# EAGLE design dacpower (EAGLE 8.1.1)
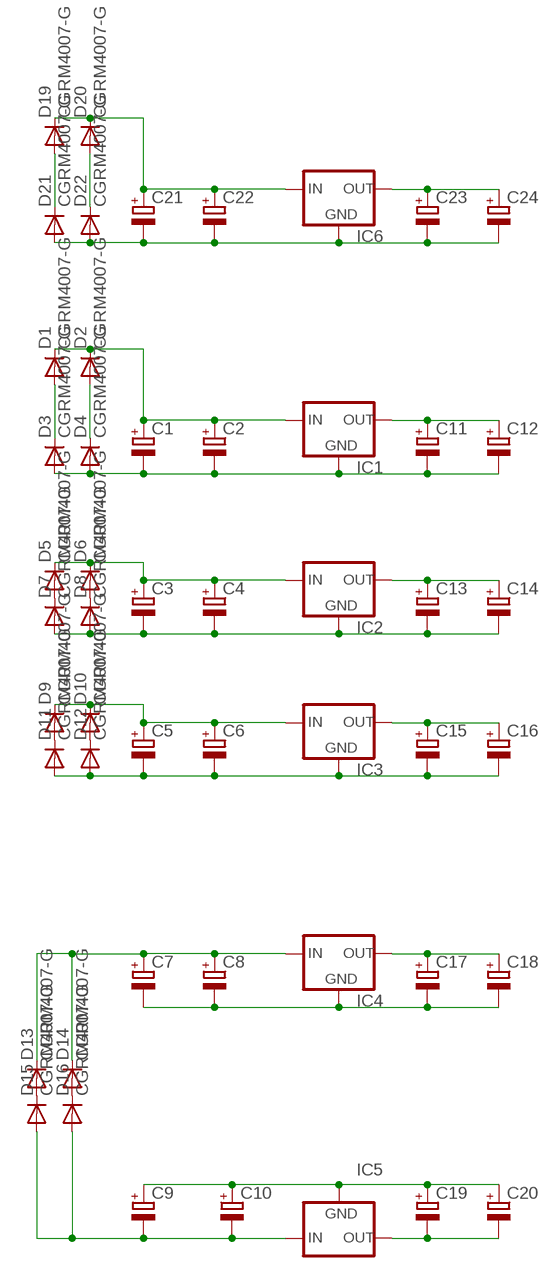
[diagram p0: schematic, sheet 1]

## Parts
C1  CPOL-EUE7.5-18  [E7,5-18]
C2  CPOL-EUE7.5-18  [E7,5-18]
C3  CPOL-EUE7.5-18  [E7,5-18]
C4  CPOL-EUE7.5-18  [E7,5-18]
C5  CPOL-EUE7.5-18  [E7,5-18]
C6  CPOL-EUE7.5-18  [E7,5-18]
C7  CPOL-EUE7.5-18  [E7,5-18]
C8  CPOL-EUE7.5-18  [E7,5-18]
C9  CPOL-EUE7.5-18  [E7,5-18]
C10  CPOL-EUE7.5-18  [E7,5-18]
C11  CPOL-EUSP-CAP-CX  [SP-CAP-CX]
C12  CPOL-EUSP-CAP-CX  [SP-CAP-CX]
C13  CPOL-EUSP-CAP-CX  [SP-CAP-CX]
C14  CPOL-EUSP-CAP-CX  [SP-CAP-CX]
C15  CPOL-EUSP-CAP-CX  [SP-CAP-CX]
C16  CPOL-EUSP-CAP-CX  [SP-CAP-CX]
C17  CPOL-EUSP-CAP-CX  [SP-CAP-CX]
C18  CPOL-EUSP-CAP-CX  [SP-CAP-CX]
C19  CPOL-EUSP-CAP-CX  [SP-CAP-CX]
C20  CPOL-EUSP-CAP-CX  [SP-CAP-CX]
C21  CPOL-EUE7.5-18  [E7,5-18]
C22  CPOL-EUE7.5-18  [E7,5-18]
C23  CPOL-EUSP-CAP-CX  [SP-CAP-CX]
C24  CPOL-EUSP-CAP-CX  [SP-CAP-CX]
D1  CGRM4007-G  [SOD-123_MINI-SMA]
D2  CGRM4007-G  [SOD-123_MINI-SMA]
D3  CGRM4007-G  [SOD-123_MINI-SMA]
D4  CGRM4007-G  [SOD-123_MINI-SMA]
D5  CGRM4007-G  [SOD-123_MINI-SMA]
D6  CGRM4007-G  [SOD-123_MINI-SMA]
D7  CGRM4007-G  [SOD-123_MINI-SMA]
D8  CGRM4007-G  [SOD-123_MINI-SMA]
D9  CGRM4007-G  [SOD-123_MINI-SMA]
D10  CGRM4007-G  [SOD-123_MINI-SMA]
D11  CGRM4007-G  [SOD-123_MINI-SMA]
D12  CGRM4007-G  [SOD-123_MINI-SMA]
D13  CGRM4007-G  [SOD-123_MINI-SMA]
D14  CGRM4007-G  [SOD-123_MINI-SMA]
D15  CGRM4007-G  [SOD-123_MINI-SMA]
D16  CGRM4007-G  [SOD-123_MINI-SMA]
D19  CGRM4007-G  [SOD-123_MINI-SMA]
D20  CGRM4007-G  [SOD-123_MINI-SMA]
D21  CGRM4007-G  [SOD-123_MINI-SMA]
D22  CGRM4007-G  [SOD-123_MINI-SMA]
IC1  78XXS  [78XXS]
IC2  78XXS  [78XXS]
IC3  78XXS  [78XXS]
IC4  78XXS  [78XXS]
IC5  79XXS  [79XXS]
IC6  78XXS  [78XXS]

## Nets
N$1: C1.+ C2.+ D1.C D2.C IC1.IN
N$2: C1.- C2.- C11.- C12.- D3.A D4.A IC1.GND
N$3: C3.+ C4.+ D5.C D6.C IC2.IN
N$4: C3.- C4.- C13.- C14.- D7.A D8.A IC2.GND
N$5: C5.+ C6.+ D9.C D10.C IC3.IN
N$6: C5.- C6.- C15.- C16.- D11.A D12.A IC3.GND
N$7: C7.+ C8.+ D13.C D14.C IC4.IN
N$8: C7.- C8.- C17.- C18.- IC4.GND
N$9: C9.+ C10.+ C19.+ C20.+ IC5.GND
N$10: C9.- C10.- D15.A D16.A IC5.IN
N$11: C19.- C20.- IC5.OUT
N$12: D1.A D3.C
N$13: C17.+ C18.+ IC4.OUT
N$14: C15.+ C16.+ IC3.OUT
N$15: C13.+ C14.+ IC2.OUT
N$16: C11.+ C12.+ IC1.OUT
N$17: D5.A D7.C
N$18: D6.A D8.C
N$19: D9.A D11.C
N$20: D10.A D12.C
N$21: D13.A D15.C
N$22: D14.A D16.C
N$23: D2.A D4.C
N$24: C21.+ C22.+ D19.C D20.C IC6.IN
N$25: C21.- C22.- C23.- C24.- D21.A D22.A IC6.GND
N$26: C23.+ C24.+ IC6.OUT
N$27: D19.A D21.C
N$28: D20.A D22.C

## Library data of the parts
C1-C24 = Vwvwbg:CPOL-EU: POLARIZED CAPACITOR, European symbol
D1-D16 D19-D22 = diode:CGRM400*-G: Molded plasitc,JEDEC SOD-123/Mini SMA Source: Comchip CGRM4001-G.pdf
IC1-IC4 IC6 = v-reg:78XXS: VOLTAGE REGULATOR
IC5 = v-reg:79XXS: VOLTAGE REGULATOR

## Board
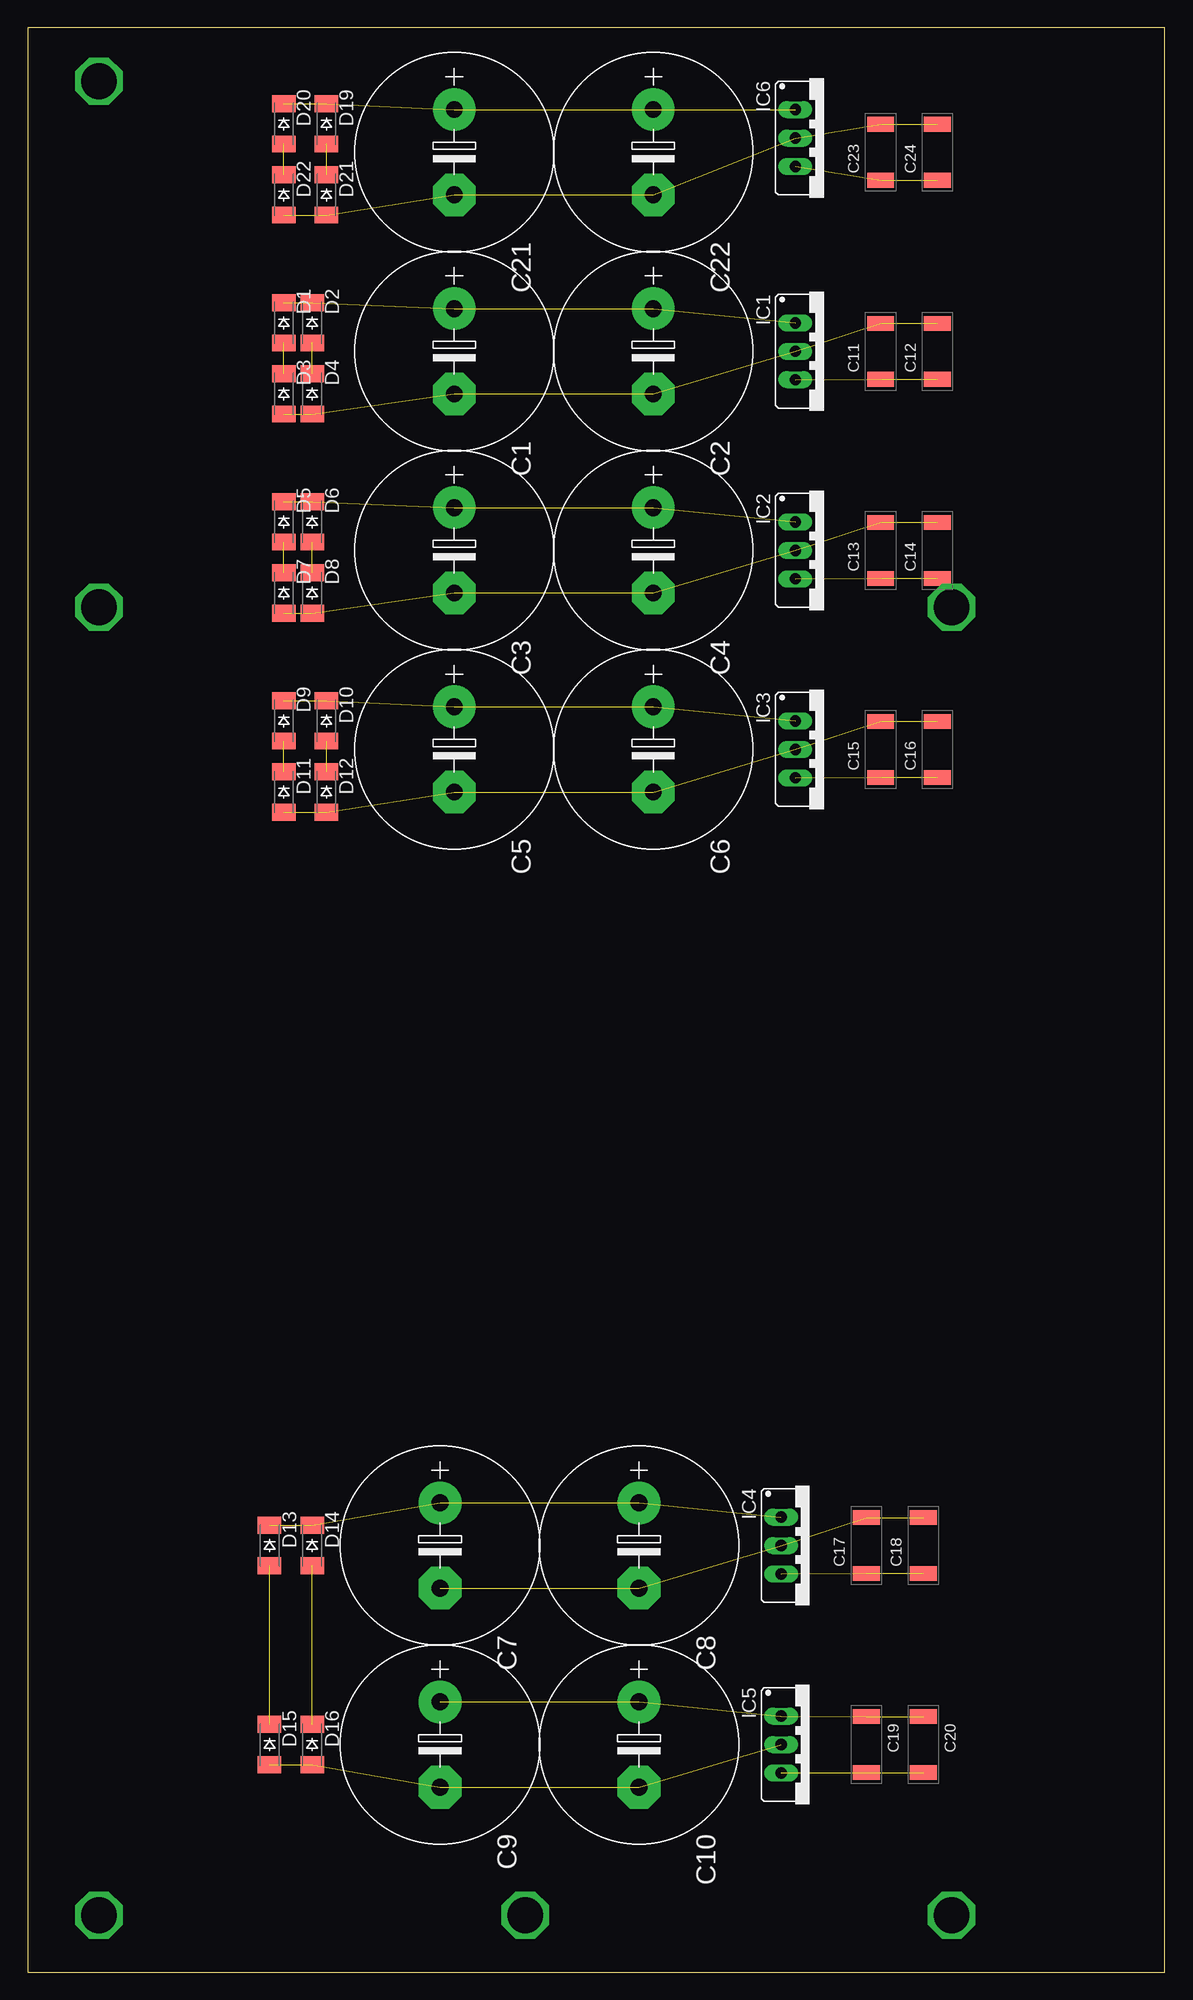
[diagram p1: board, top side]

Size 101.58 x 173.66 mm. Coordinates in mm from the lower left corner, seen from the top.
Outline: 0,0 101.58,0 101.58,173.66 0,173.66 0,0
Copper layers (1*16): Top 0.035mm / dielectric 1.5mm / Bottom 0.035mm
Design rules "default": minimum track width 10mil, minimum drill 24mil, track to track 8mil, track to pad 8mil, pad to pad 8mil, via to via 8mil, smd to smd 8mil, copper to edge 40mil, drill to drill 8mil, minimum pad ring 10mil, minimum via ring 8mil, stop-mask expansion 4mil, vias tented up to drill 0mil, thermal gap 10mil

### Footprints (pad centres in the part's own frame; a part is rotated, then mirrored left to right if it is on the bottom)
E7,5-18 = drill 1.5 pad 3.81: + -3.81,0 | drill 1.5 pad 3.81 octagon: - 3.81,0
SP-CAP-CX = smd 1.3 x 2.4: + -2.5,0; - 2.5,0
SOD-123_MINI-SMA = smd 1.5 x 2.1: A 1.8,0; C -1.8,0
78XXS = drill 1.016 long: GND 0,-2.54; IN -2.54,-2.54; OUT 2.54,-2.54
79XXS = drill 1.016 long: GND -2.54,-2.54; IN 0,-2.54; OUT 2.54,-2.54

### Placement (x,y rotation side)
C1  38.1,144.78 270 top
C2  55.88,144.78 270 top
C3  38.1,127 270 top
C4  55.88,127 270 top
C5  38.1,109.22 270 top
C6  55.88,109.22 270 top
C7  36.83,38.1 270 top
C8  54.61,38.1 270 top
C9  36.83,20.32 270 top
C10  54.61,20.32 270 top
C11  76.2,144.78 90 top
C12  81.28,144.78 90 top
C13  76.2,127 90 top
C14  81.28,127 90 top
C15  76.2,109.22 90 top
C16  81.28,109.22 90 top
C17  74.93,38.1 90 top
C18  80.01,38.1 90 top
C19  74.93,20.32 270 top
C20  80.01,20.32 270 top
C21  38.1,162.56 270 top
C22  55.88,162.56 270 top
C23  76.2,162.56 90 top
C24  81.28,162.56 90 top
D1  22.86,147.32 270 top
D2  25.4,147.32 270 top
D3  22.86,140.97 270 top
D4  25.4,140.97 270 top
D5  22.86,129.54 270 top
D6  25.4,129.54 270 top
D7  22.86,123.19 270 top
D8  25.4,123.19 270 top
D9  22.86,111.76 270 top
D10  26.67,111.76 270 top
D11  22.86,105.41 270 top
D12  26.67,105.41 270 top
D13  21.59,38.1 270 top
D14  25.4,38.1 270 top
D15  21.59,20.32 270 top
D16  25.4,20.32 270 top
D19  26.67,165.1 270 top
D20  22.86,165.1 270 top
D21  26.67,158.75 270 top
D22  22.86,158.75 270 top
IC1  71.12,144.78 270 top
IC2  71.12,127 270 top
IC3  71.12,109.22 270 top
IC4  69.85,38.1 270 top
IC5  69.85,20.32 270 top
IC6  71.12,163.83 270 top

### Tracks (layer width: path | path; a pad name or v marks a point on that pad's centre or on a via)
N$1  (4 unrouted)
N$2  (6 unrouted)
N$3  (4 unrouted)
N$4  (6 unrouted)
N$5  (4 unrouted)
N$6  (6 unrouted)
N$7  (4 unrouted)
N$8  (4 unrouted)
N$9  (4 unrouted)
N$10  (4 unrouted)
N$11  (2 unrouted)
N$12  (1 unrouted)
N$13  (2 unrouted)
N$14  (2 unrouted)
N$15  (2 unrouted)
N$16  (2 unrouted)
N$17  (1 unrouted)
N$18  (1 unrouted)
N$19  (1 unrouted)
N$20  (1 unrouted)
N$21  (1 unrouted)
N$22  (1 unrouted)
N$23  (1 unrouted)
N$24  (4 unrouted)
N$25  (6 unrouted)
N$26  (2 unrouted)
N$27  (1 unrouted)
N$28  (1 unrouted)
N$29  (via drill 3.2 pad 1.78)
  other vias: 6.35,5.08 44.45,5.08 82.55,5.08 6.35,121.92 82.55,121.92 6.35,168.91